# Altium schematic sheet Schematic_V№3.SchDoc
size A4
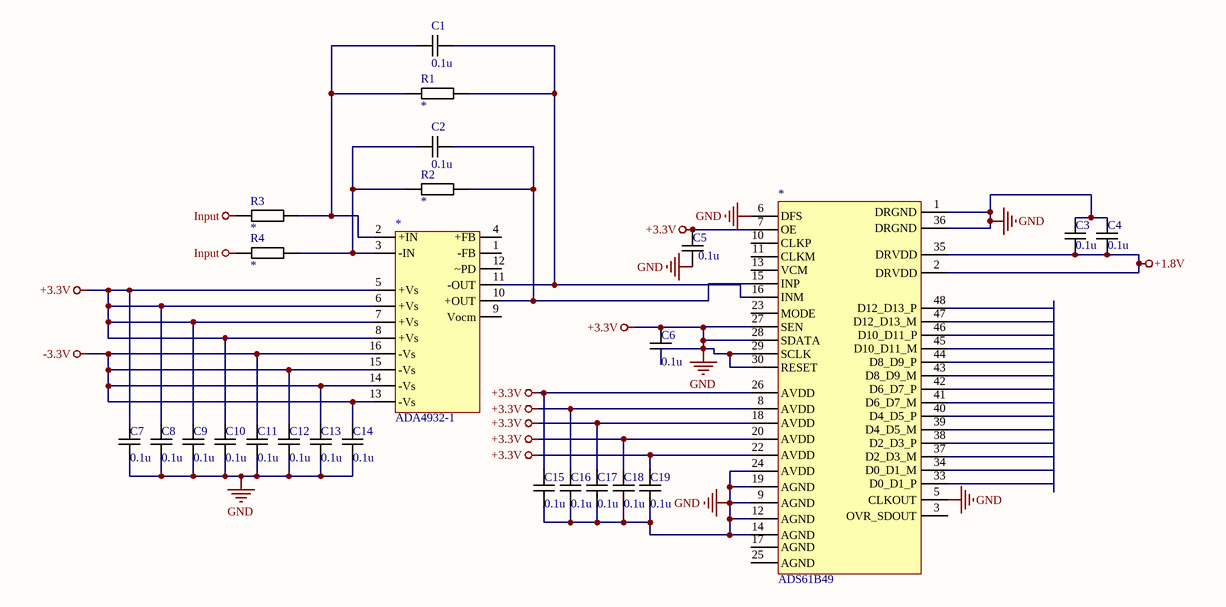
[diagram p0: Schematic_V№3.SchDoc]

## Parts
(Parts that share a designator on the sheet are numbered #1, #2 ... from top to bottom, then left to right.)
*#1  ADA4932-1  [ADA4932-1]
*#2  ADS61B49  [ADS61B49]
C1  0.1u  [Capacitor]
C2  0.1u  [Capacitor]
C3  0.1u  [Capacitor]
C4  0.1u  [Capacitor]
C5  0.1u  [Capacitor]
C6  0.1u  [Capacitor]
C7  0.1u  [Capacitor]
C8  0.1u  [Capacitor]
C9  0.1u  [Capacitor]
C10  0.1u  [Capacitor]
C11  0.1u  [Capacitor]
C12  0.1u  [Capacitor]
C13  0.1u  [Capacitor]
C14  0.1u  [Capacitor]
C15  0.1u  [Capacitor]
C16  0.1u  [Capacitor]
C17  0.1u  [Capacitor]
C18  0.1u  [Capacitor]
C19  0.1u  [Capacitor]
R1  *  [Resistor]
R2  *  [Resistor]
R3  *  [Resistor]
R4  *  [Resistor]

## Nets
+1.8V: *#2.2(DRVDD) *#2.35(DRVDD) C3.1 C4.1
+3.3V: *#1.5(+Vs) *#1.6(+Vs) *#1.7(+Vs) *#1.8(+Vs) *#2.1(DRGND) *#2.5(CLKOUT) *#2.6(DFS) *#2.7(OE) *#2.8(AVDD) *#2.9(AGND) *#2.12(AGND) *#2.14(AGND) *#2.18(AVDD) *#2.19(AGND) *#2.20(AVDD) *#2.22(AVDD) *#2.24(AVDD) *#2.26(AVDD) *#2.27(SEN) *#2.28(SDATA) *#2.29(SCLK) *#2.30(RESET) *#2.36(DRGND) C3.2 C4.2 C5.1 C5.2 C6.1 C6.2 C7.1 C7.2 C8.1 C8.2 C9.1 C9.2 C10.1 C10.2 C11.1 C12.1 C13.1 C14.1 C15.1 C15.2 C16.1 C16.2 C17.1 C17.2 C18.1 C18.2 C19.1 C19.2  [also labelled GND]
-3.3V: *#1.13(-Vs) *#1.14(-Vs) *#1.15(-Vs) *#1.16(-Vs) C11.2 C12.2 C13.2 C14.2
Input: R3.1 R4.1
Net*#1_2: *#1.2(+IN) C1.2 R1.1 R3.2
Net*#1_3: *#1.3(-IN) C2.2 R2.1 R4.2
Net*#1_10: *#1.10(+OUT) *#2.15(INP) C2.1 R2.2
Net*#1_11: *#1.11(-OUT) *#2.16(INM) C1.1 R1.2

Not connected (* = marked no-connect by the designer): *#1 1(-FB) 4(+FB) 9(Vocm) 12(~PD); *#2 3(OVR_SDOUT) 10(CLKP) 11(CLKM) 13(VCM) 17(AGND) 23(MODE) 25(AGND) 33(D0_D1_P) 34(D0_D1_M) 37(D2_D3_M) 38(D2_D3_P) 39(D4_D5_M) 40(D4_D5_P) 41(D6_D7_M) 42(D6_D7_P) 43(D8_D9_M) 44(D8_D9_P) 45(D10_D11_M) 46(D10_D11_P) 47(D12_D13_M) 48(D12_D13_P)

## Library data of the parts
C1-C19 = Capacitor
R1-R4 = Resistor